# Altium schematic sheet vaja1.SchDoc
size A4; SheetNumber: 1; SheetTotal: 1
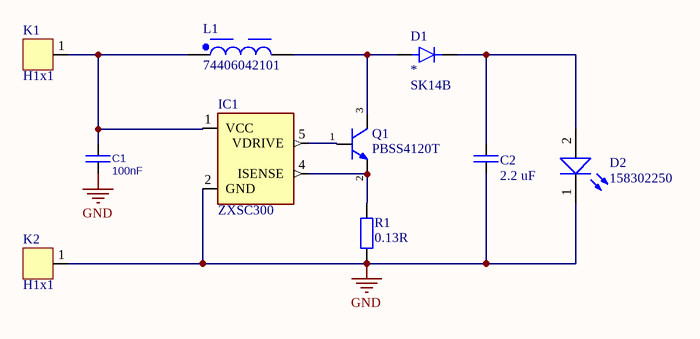
[diagram p0: vaja1.SchDoc]

## Parts
C1  value 100nF  [C0805]
C2  2.2 uF  [C0805(2012)_M]
D1  SK14B  [DIOM4336X265N]
D2  158302250  [WL-SWTP_3022_L3W2H0.8]
IC1  ZXSC300  [SOT23-5]
K1  H1x1  [H1x1]
K2  H1x1  [H1x1]
L1  74406042101  [WE-LQFS_4818]
Q1  PBSS4120T  [SOT23-3_N]
R1  0.13R  [R0805(2012)_M]

## Nets
GND: C1.2 C2.2 D2.1(K) IC1.2(GND) K2.1 R1.2
NetC1_1: C1.1 IC1.1(VCC) K1.1 L1.1
NetC2_1: C2.1 D1.C(K) D2.2(A)
NetD1_A: D1.A L1.2 Q1.3(C)
NetIC1_4: IC1.4(ISENSE) Q1.2(E) R1.1
NetIC1_5: IC1.5(VDRIVE) Q1.1(B)

## Library data of the parts
C1 = CMP-085-000000-1: Capacitor; Source: Battery charger.SCHLIB; Design Item ID: C; Pin Count: 2; Component Type: Standard
C2 = CMP-031-000008-1: Capacitor; Pin Count: 2; Design Item ID: C; Component Type: Standard; Source: MISKO.SCHLIB
D1 = CMP-103-000087-1: Design Item ID: SK14B; Price: None; Source: SK14B.SchLib; Component Type: Standard; Pin Count: 2; Availability: Unavailable; Case/Package: None; MP: SK14B; Value: *
D2 = CMP-022-000013-1: WL-SWTP SMT White Top view PLCC, size 3022, Daylight, 3.2V, 120°; Manufacturer: Wurth Elektronik; Chip Technology: InGaN; Color Rendering Index: 85; Luminous Flux: 22lm; Correlated Color Temperature: 5000K; Case/Size Code: 3022; Design Item ID: 158302250; ComponentLink1Description: Website Link; Mount: Surface Mount; Packaging: Tape and Reel; Viewing Angle: 120°; Pin Count: 2; Height: 0.8mm; ComponentLink2Description: Datasheet Link; Category: General Lighting; ComponentLink2URL: https://www.we-online.com/redexpert/spec/158302250?ad; Forward Voltage: 3.2V; Length: 3mm; Match Code: WL-SWTP; Width: 2mm; Manufacturer Part Number: 158302250; Emitting Color: Daylight; Operating Temperature Max: 85°C; Operating Temperature Min: -40°C; ComponentLink1URL: https://www.we-online.com/redexpert/article/158302250?ad; Source: WL-SWTP.SchLib; Component Type: Standard
IC1 = CMP-026-000242-1: LED Driver 1 Segment 4000uA Supply Current 5-Pin SOT-23 T/R; MF: Diodes Zetex; Package: None; Design Item ID: ZXSC300; Check_prices: https://www.snapeda.com/parts/ZXSC300/Zetex/view-part/?ref=eda; MP: ZXSC300; Source: ZXSC300.SchLib; Pin Count: 4; Component Type: Standard; SnapEDA_Link: https://www.snapeda.com/parts/ZXSC300/Zetex/view-part/?ref=snap; Value: *
K1 K2 = CMP-113-000000-1: Header 1x1 (male); Design Item ID: H1x1; Pin Count: 1; Source: Kon_Tipk.SchLib; Component Type: Standard
L1 = CMP-010-000050-1: WE-LQFS SMT Power Inductor, size 4818, 100µH, 0.42A, 1386mO; Manufacturer: Wurth Elektronik; Self Resonant Frequency: 15MHz; Case/Size Code: 4818; DC Resistance: 1155mO; Saturation Current: 0.32A; Mount: Surface Mount; Match Code: WE-LQFS; Operating Temperature Min: -40°C; Operating Temperature Max: 125°C; Height: 1.8mm; ComponentLink2URL: https://www.we-online.com/redexpert/spec/74406042101?ad; Design Item ID: 74406042101; Packaging: Tape and Reel; Pin Count: 2; DC Resistance Max: 1386mO; Source: WE-LQFS.SchLib; Component Type: Standard; Inductance: 100µH; Width: 4.8mm; Length: 4.8mm; ComponentLink2Description: Datasheet Link; Rated Current: 0.42A; ComponentLink1URL: https://www.we-online.com/redexpert/article/74406042101?ad; Manufacturer Part Number: 74406042101; Category: Shielded Power Inductors; ComponentLink1Description: Website Link
Q1 = CMP-018-000001-1: Design Item ID: Transistor BJT NPN; Source: generic library.SchLib
R1 = CMP-036-000000-1: R; Component Type: Standard; Source: MISKO.SCHLIB; Design Item ID: R; Pin Count: 2